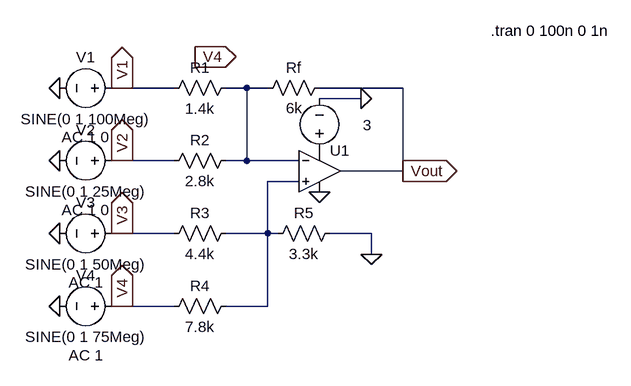
[diagram p0: schematic opamp.asc]
opamp.asc, the LTspice schematic file:
Version 4
SHEET 1 880 680
WIRE -112 48 -128 48
WIRE -32 48 -112 48
WIRE 80 48 48 48
WIRE 112 48 80 48
WIRE 320 48 192 48
WIRE 256 64 192 64
WIRE -112 160 -128 160
WIRE -32 160 -112 160
WIRE 80 160 80 48
WIRE 80 160 48 160
WIRE 160 160 80 160
WIRE 320 176 320 48
WIRE 320 176 224 176
WIRE 160 192 112 192
WIRE -112 272 -128 272
WIRE -32 272 -112 272
WIRE 112 272 112 192
WIRE 112 272 48 272
WIRE 128 272 112 272
WIRE 272 272 208 272
WIRE 272 304 272 272
WIRE -112 384 -128 384
WIRE -32 384 -112 384
WIRE 112 384 112 272
WIRE 112 384 48 384
FLAG 192 208 0
FLAG 272 304 0
FLAG 256 64 0
FLAG -208 48 0
FLAG -208 160 0
FLAG -208 272 0
FLAG -208 384 0
FLAG 320 176 Vout
IOPIN 320 176 Out
FLAG -112 48 V1
IOPIN -112 48 Out
FLAG -112 160 V2
IOPIN -112 160 Out
FLAG -112 272 V3
IOPIN -112 272 Out
FLAG -112 384 V4
IOPIN -112 384 Out
FLAG 0 0 V4
IOPIN 0 0 Out
SYMBOL res 64 32 R90
WINDOW 0 0 56 VBottom 2
WINDOW 3 32 56 VTop 2
SYMATTR InstName R1
SYMATTR Value 1.4k
SYMBOL res 64 144 R90
WINDOW 0 0 56 VBottom 2
WINDOW 3 32 56 VTop 2
SYMATTR InstName R2
SYMATTR Value 2.8k
SYMBOL res 64 256 R90
WINDOW 0 0 56 VBottom 2
WINDOW 3 32 56 VTop 2
SYMATTR InstName R3
SYMATTR Value 4.4k
SYMBOL res 64 368 R90
WINDOW 0 0 56 VBottom 2
WINDOW 3 32 56 VTop 2
SYMATTR InstName R4
SYMATTR Value 7.8k
SYMBOL voltage -112 48 R90
WINDOW 0 -32 56 VBottom 2
WINDOW 3 32 56 VTop 2
WINDOW 123 60 56 VTop 2
WINDOW 39 0 0 Left 0
SYMATTR InstName V1
SYMATTR Value SINE(0 1 100Meg)
SYMATTR Value2 AC 1 0
SYMBOL voltage -112 160 R90
WINDOW 0 -32 56 VBottom 2
WINDOW 3 32 56 VTop 2
WINDOW 123 60 56 VTop 2
WINDOW 39 0 0 Left 0
SYMATTR InstName V2
SYMATTR Value SINE(0 1 25Meg)
SYMATTR Value2 AC 1 0
SYMBOL voltage -112 272 R90
WINDOW 0 -32 56 VBottom 2
WINDOW 3 32 56 VTop 2
WINDOW 123 60 56 VTop 2
WINDOW 39 0 0 Left 0
SYMATTR InstName V3
SYMATTR Value SINE(0 1 50Meg)
SYMATTR Value2 AC 1
SYMBOL voltage -112 384 R90
WINDOW 0 -32 56 VBottom 2
WINDOW 3 32 56 VTop 2
WINDOW 123 60 56 VTop 2
WINDOW 39 0 0 Left 0
SYMATTR InstName V4
SYMATTR Value SINE(0 1 75Meg)
SYMATTR Value2 AC 1
SYMBOL res 208 32 R90
WINDOW 0 0 56 VBottom 2
WINDOW 3 31 55 VTop 2
SYMATTR InstName Rf
SYMATTR Value 6k
SYMBOL res 224 256 R90
WINDOW 0 0 56 VBottom 2
WINDOW 3 32 56 VTop 2
SYMATTR InstName R5
SYMATTR Value 3.3k
SYMBOL voltage 192 160 R180
WINDOW 0 -51 66 Invisible 2
WINDOW 3 -80 55 Left 2
WINDOW 123 0 0 Left 0
WINDOW 39 0 0 Left 0
SYMATTR InstName V5
SYMATTR Value 3
SYMBOL OpAmps\\UniversalOpAmp 192 176 R0
SYMATTR InstName U1
TEXT 456 -40 Left 2 !.tran 0 100n 0 1n

The netlist it stands for:
* opamp.asc
R1 N001 V1 1.4k
R2 N001 V2 2.8k
R3 N002 V3 4.4k
R4 N002 V4 7.8k
V1 V1 0 SINE(0 1 100Meg) AC 1 0
V2 V2 0 SINE(0 1 25Meg) AC 1 0
V3 V3 0 SINE(0 1 50Meg) AC 1
V4 V4 0 SINE(0 1 75Meg) AC 1
Rf Vout N001 6k
R5 0 N002 3.3k
V5 P001 0 3
XU1 N002 N001 P001 0 Vout level1 Avol=1Meg GBW=10Meg Vos=0 En=0 Enk=0 In=0 Ink=0 Rin=500Meg  ; pins In+ In- V+ V- OUT
.tran 0 100n 0 1n
.lib UniversalOpAmp1.lib
.backanno
.end